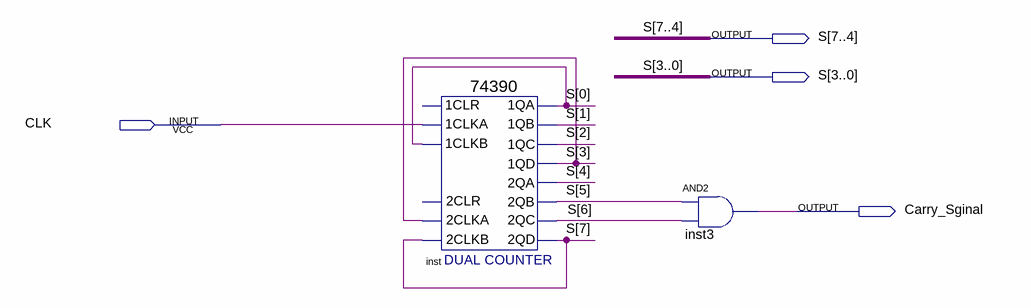
[diagram p0: schematic sheet]
// Quartus schematic Second_Count.bdf as structural Verilog: 2 symbols, 4 pins
module Second_Count (
  input  CLK,
  output [7:0] S,
  output Carry_Sginal
);

  \74390  inst (
    .\2CLKA (S[3]), .\2CLKB (S[7]), .\1CLKA (CLK), .\1CLKB (S[0]), .\1QA (S[0]), .\1QB (S[1]), .\1QC (S[2]),
    .\1QD (S[3]), .\2QA (S[4]), .\2QB (S[5]), .\2QC (S[6]), .\2QD (S[7]));  // open: 2CLR, 1CLR
  and inst3 (Carry_Sginal, S[5], S[6]);
endmodule
